# EAGLE design RoboSkin (EAGLE 9.5.2)
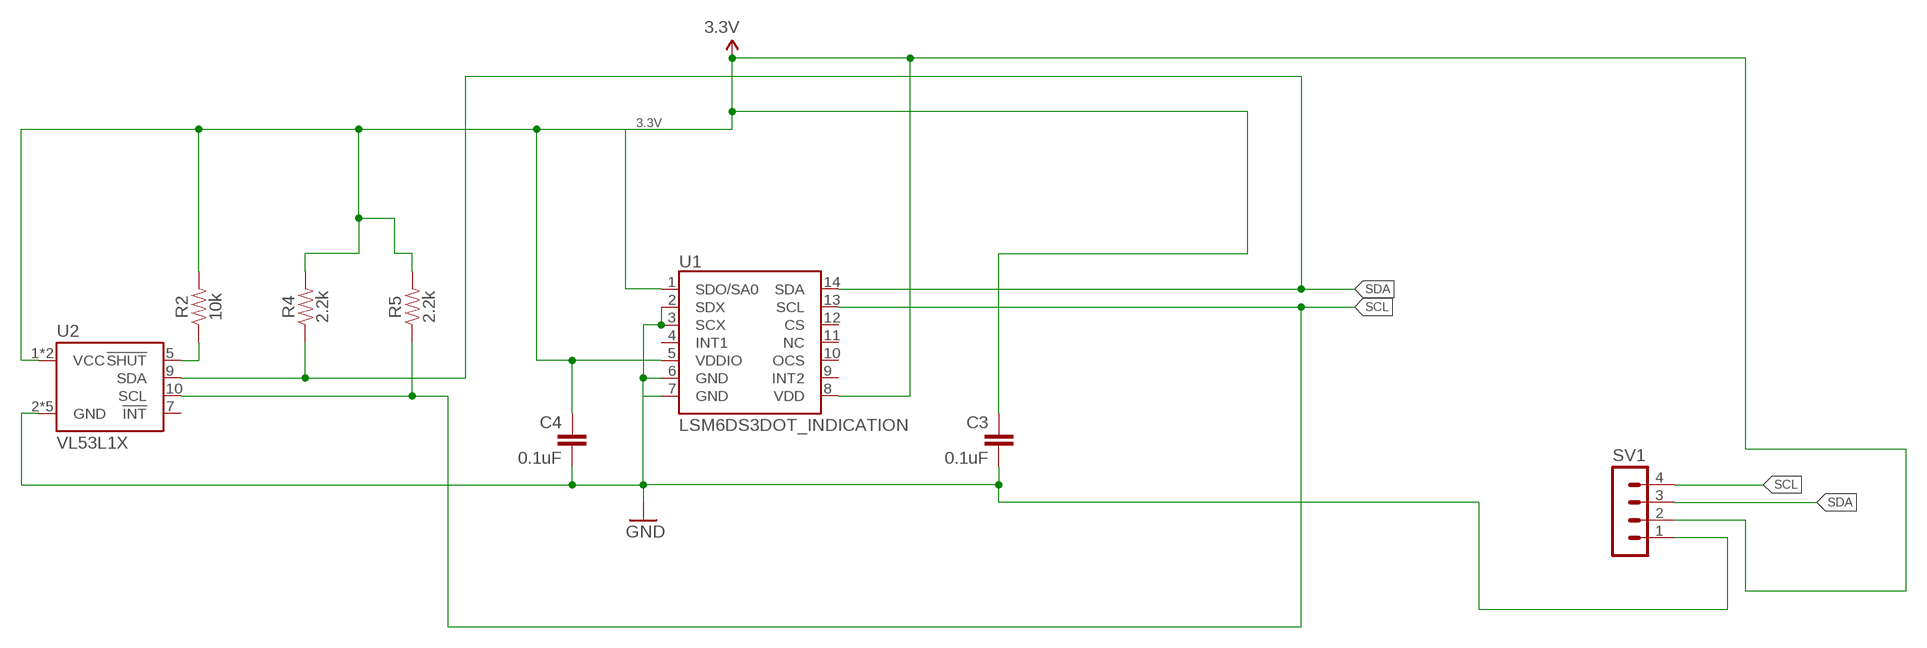
[diagram p0: schematic, sheet 1]

## Parts
C3  0.1uF  0.1UF-100V-10%(0603)  [0603-CAP]
C4  0.1uF  0.1UF-100V-10%(0603)  [0603-CAP]
R2  10k  10KOHM-0603-1/10W-1%  [0603]
R4  2.2k  2.2KOHM-0603-1/10W-1%  [0603]
R5  2.2k  2.2KOHM-0603-1/10W-1%  [0603]
SV1  MA04-1  [MA04-1]
U1  LSM6DS3DOT_INDICATION  [LGA14L_DOT_INDICATOR]
U2  VL53L1X  VL53L1XSMD  [VL53L1X]

## Nets
3.3V: C3.1 C4.1 R2.2 R4.2 R5.2 SV1.2 U1.1(SDO/SA0) U1.5(VDDIO) U1.8(VDD) U2.1(VCC) U2.11(VCC)
!SHUT: R2.1 U2.5(!SHUT)
GND: C3.2 C4.2 SV1.1 U1.2(SDX) U1.3(SCX) U1.6(GND) U1.7(GND) U2.2(GND) U2.3(GND) U2.4(GND) U2.6(GND) U2.12(GND)
SCL: R5.1 SV1.4 U1.13(SCL) U2.10(SCL)
SDA: R4.1 SV1.3 U1.14(SDA) U2.9(SDA)
Unconnected: U1.4(INT1) U1.9(INT2) U1.10(OCS) U1.11(NC) U1.12(CS) U2.7(!INT)

## Library data of the parts
C3 C4 = SparkFun-Capacitors:0.1UF-100V-10%(0603): CAP-08390; PROD_ID: CAP-08390
R2 = SparkFun-Resistors:10KOHM: 10kΩ resistor A resistor is a passive two-terminal electrical component that implements electrical resistance as a circuit element. Resistors act to reduce current flow, and, at the same time, act to lower voltage levels within circuits. - Wikipedia; PROD_ID: RES-00824
R4 R5 = SparkFun-Resistors:2.2KOHM: 2.2kΩ resistor A resistor is a passive two-terminal electrical component that implements electrical resistance as a circuit element. Resistors act to reduce current flow, and, at the same time, act to lower voltage levels within circuits. - Wikipedia; PROD_ID: RES-08272
SV1 = con-lstb:MA04-1: PIN HEADER; OC_FARNELL: unknown; OC_NEWARK: unknown
U1 = LSM6DS3:LSM6DS3; PROD_ID: IC-12969
U2 = SparkFun-Sensors:VL53L1X: STMicroelectronics VL53L1X - 400 cm IR Laser ToF Sensor VL53L1X is a state-of-the-art ToF laser-ranging sensor, enhancing the ST FlightSense product family. It is the fastest miniature ToF sensor currently on the market with accurate ranging up to 4 m and fast ranging frequency (up to 50 Hz). Housed in a miniature and reflowable package, it integrates a single photon avalanche diode (SPAD) receiving array, a 940 nm invisible laser Class 1 emitter, physical infrared filters, and optics to achieve the best ranging performance in various ambient lighting conditions with a range of cover window options.; PROD_ID: IC-13960

## Board
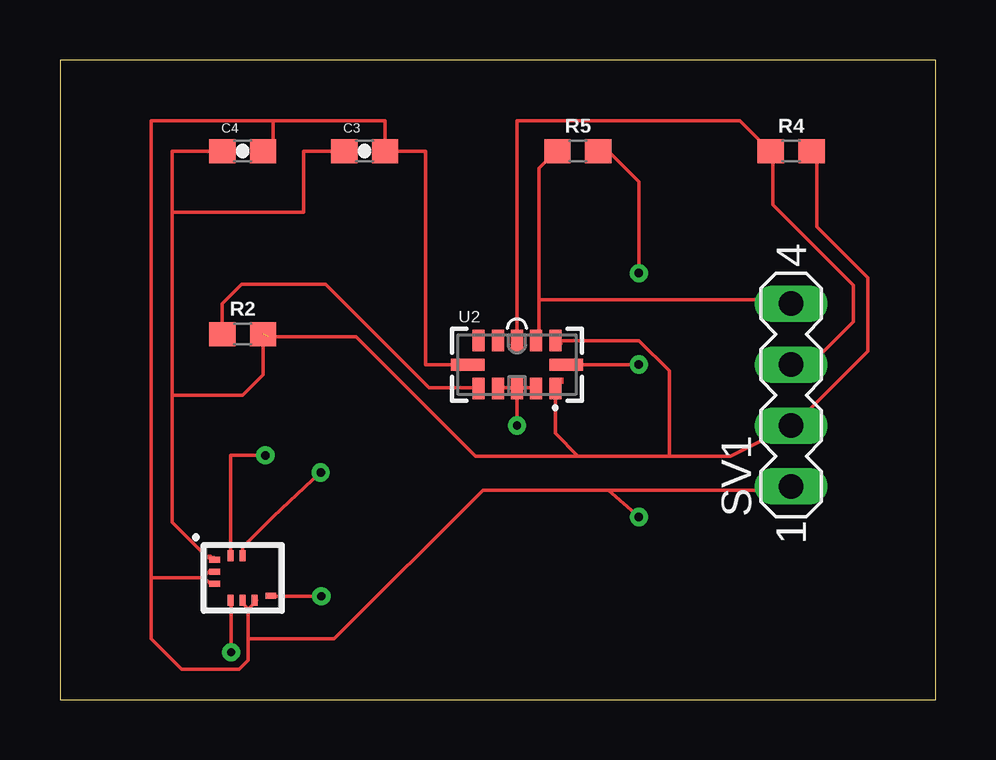
[diagram p1: board, top side]
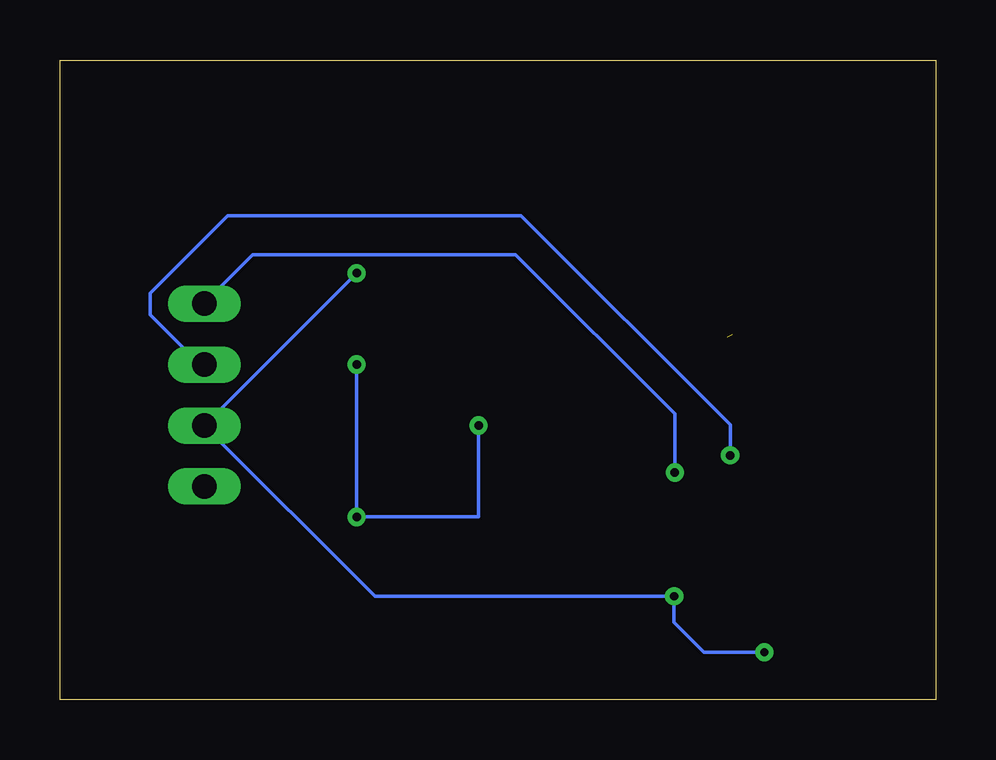
[diagram p2: board, bottom side, seen from below]

Size 36.5 x 26.66 mm. Coordinates in mm from the lower left corner, seen from the top.
Outline: 0,0 36.5,0 36.5,26.66 0,26.66 0,0
Copper layers (1*16): Top 0.035mm / dielectric 1.5mm / Bottom 0.035mm
Design rules "default *": minimum track width 6mil, minimum drill 0.35mm, track to track 8mil, track to pad 8mil, pad to pad 6mil, via to via 12mil, smd to smd 6mil, copper to edge 40mil, drill to drill 6mil, minimum pad ring 10mil, minimum via ring 8mil, stop-mask expansion 4mil, vias tented up to drill 0mil, thermal gap 10mil

### Footprints (pad centres in the part's own frame; a part is rotated, then mirrored left to right if it is on the bottom)
0603-CAP = smd 1.1 x 1: 1 -0.85,0; 2 0.85,0
0603 = smd 1.1 x 1: 1 -0.85,0; 2 0.85,0
MA04-1 = drill 1.016 long: 1 -3.81,0; 2 -1.27,0; 3 1.27,0; 4 3.81,0
LGA14L_DOT_INDICATOR = smd 0.45 x 0.25: 1 -1.175,0.75; 2 -1.175,0.25; 3 -1.175,-0.25; 8 1.175,-0.75 | smd 0 x 0: 4 -1.175,-0.75; 9 1.175,-0.25; 10 1.175,0.25; 11 1.175,0.75; 12 0.5,0.925 | smd 0.25 x 0.45: 5 -0.5,-0.925; 6 0,-0.925; 7 0.5,-0.925; 13 0,0.925; 14 -0.5,0.925
VL53L1X = smd 0.5 x 0.9: 1 1.6,-1; 2 0.8,-1; 3 0,-1; 4 -0.8,-1; 5 -1.6,-1; 7 -1.6,1; 8 -0.8,1; 9 0,1; 10 0.8,1; 11 1.6,1 | smd 1.4 x 0.5: 6 -2.05,0; 12 2.05,0

### Placement (x,y rotation side)
C3  12.7,22.86 0 top
C4  7.62,22.86 0 top
R2  7.62,15.24 0 top
R4  30.48,22.86 0 top
R5  21.59,22.86 0 top
SV1  30.48,12.7 90 top
U1  7.62,5.08 0 top
U2  19.05,13.97 0 top

### Tracks (layer width: path | path; a pad name or v marks a point on that pad's centre or on a via)
3.3V  (via drill 0.35)  (1 unrouted)
  Top 0.152: 11.68,22.76 C3.1 10.16,22.86 10.16,20.32 4.67,20.32 | 20.88,14.83 U2.11 24.13,14.97 25.4,13.7 25.4,10.16 | R4.2 31.55,22.76 31.55,19.71 33.68,17.58 33.68,14.53 30.63,11.48 SV1.2 27.94,10.16 25.4,10.16 | 8.69,15.14 12.34,15.14 17.32,10.16 21.59,10.16 | v24.13,17.78 24.13,21.59 22.86,22.86 R5.2 | 6.07,5.92 6.35,5.92 | 6.35,5.92 6.43,5.92 U1.1 | v7.14,1.98 7.14,4.14 U1.5 | v10.9,4.32 8.91,4.32 U1.8 | U2.1 20.65,12.85 20.65,11.1 21.59,10.16 | C4.1 4.67,22.86 4.67,20.32 | 21.59,10.16 25.4,10.16 | 6.35,5.92 6.28,5.98 6.09,5.98 4.67,7.4 4.67,12.7 | 4.67,12.7 4.67,20.32 | R2.2 8.47,13.55 7.62,12.7 4.67,12.7
  Bottom 0.152: v7.14,1.98 9.65,1.98 10.9,3.23 v10.9,4.32 23.37,4.32 SV1.2 v24.13,17.78
!SHUT
  Top 0.152: U2.5 17.22,13 15.39,13 11.07,17.32 7.58,17.32 6.77,16.51 R2.1
GND  (via drill 0.35)
  Top 0.152: 19.05,13 18.52,13 | 18.52,13 18.44,13 U2.4 | 19.05,13 19.66,13 U2.2 | 19.05,13 U2.3 v19.05,11.43 | 17.45,13.92 17.22,13.92 U2.6 | 13.51,23.06 C3.2 | 8.38,23.06 C4.2 8.69,23.06 8.89,23.06 8.89,24.13 | 16.92,13.92 U2.6 | C3.2 15.24,22.86 15.24,13.97 U2.6 | 22.86,8.74 17.63,8.74 11.43,2.54 7.85,2.54 | 22.86,8.74 30.33,8.74 SV1.1 | 19.69,13.33 U2.2 | 5.98,5.12 6.25,4.85 U1.3 | 5.98,5.12 6.25,5.38 6.43,5.38 U1.2 | 7.85,3.78 7.67,3.96 7.67,4.14 U1.6 | 7.85,3.78 8.2,4.14 U1.7 | 7.85,2.54 7.85,1.65 7.47,1.27 5.08,1.27 3.81,2.54 3.81,5.08 | 7.85,2.54 7.85,3.78 | 3.81,5.08 3.81,24.13 8.89,24.13 | C3.2 13.55,24.13 8.89,24.13 | 17.63,13.92 17.45,13.92 | 17.45,13.92 U2.6 | 18.52,13.03 18.52,13 | 20.47,13.92 21.01,13.92 U2.12 v24.13,13.97 | 19.76,13.21 U2.2 | 22.86,8.74 v24.13,7.62 | 5.98,5.12 5.94,5.08 3.81,5.08
  Bottom 0.152: v24.13,13.97 v24.13,7.62 19.05,7.62 v19.05,11.43
SCL  (via drill 0.35)
  Top 0.152: 19.96,16.66 19.96,22.15 20.57,22.76 R5.1 | 19.96,16.66 19.96,15.14 U2.10 | 19.96,16.66 30.33,16.66 SV1.4 | 7.67,6.1 U1.13 7.62,6.35 8.89,7.62 v10.87,9.47
  Bottom 0.152: v10.87,9.47 10.87,11.91 17.5,18.54 28.47,18.54 30.43,16.59 SV1.4
SDA  (via drill 0.35)
  Top 0.152: SV1.3 30.63,14.22 31.55,14.22 33.07,15.75 33.07,17.27 29.72,20.62 29.72,22.76 R4.1 29.41,23.06 28.35,24.13 19.05,24.13 U2.9 | U1.14 7.12,10.18 v8.56,10.18
  Bottom 0.152: v8.56,10.18 8.56,11.45 17.27,20.17 29.52,20.17 32.74,16.94 32.74,16.05 30.61,13.92 SV1.3